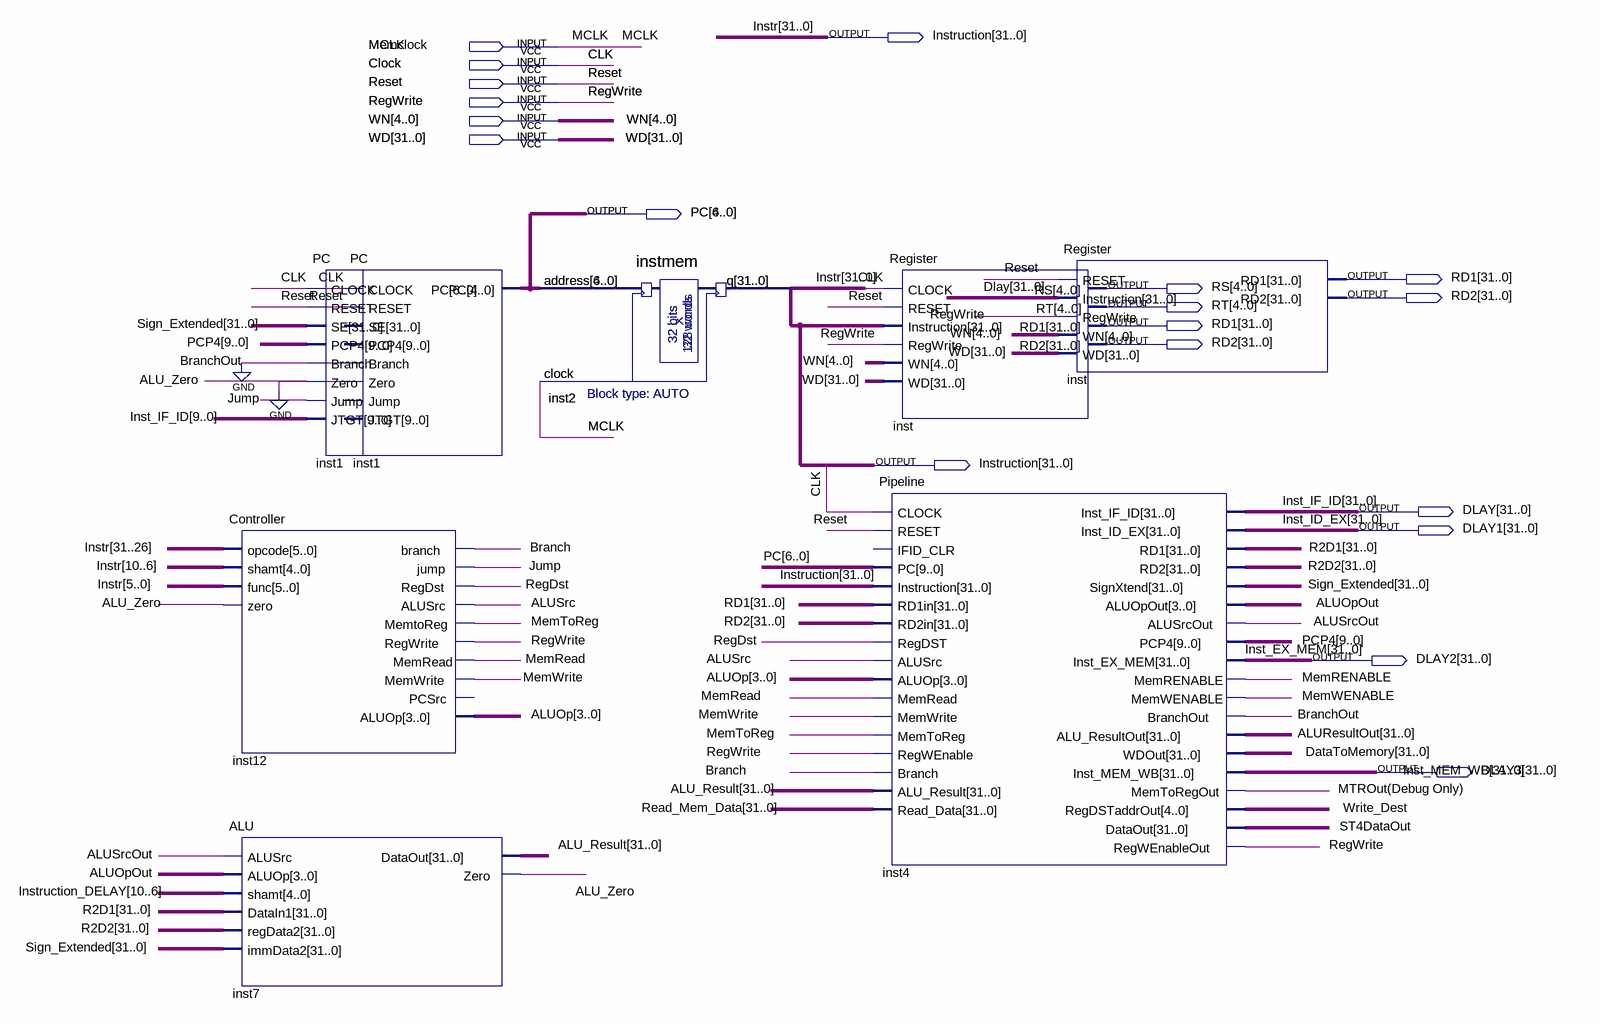
[diagram p0: schematic sheet]
// Quartus schematic TESTER.bdf as structural Verilog: 9 symbols, 26 pins
module TESTER (
  input  Memclock,
  input  MCLK,
  input  Clock,
  input  Reset,
  input  RegWrite,
  input  [4:0] WN,
  input  [31:0] WD,
  output [31:0] Instruction,
  output [6:0] PC,
  output [31:0] RD1,
  output [4:0] RS,
  output [31:0] RD2,
  output [4:0] RT,
  output [31:0] DLAY,
  output [31:0] DLAY1,
  output [31:0] DLAY2,
  output [31:0] DLAY3
);

  wire ALU_Zero, ALUOpOut, ALUSrc, ALUSrcOut, Branch, BranchOut, Jump, MemRead, MemRENABLE, MemToReg,
       MemWENABLE, MemWrite, \MTROut(Debug_Only) , RegDst, ST4DataOut, Write_Dest;
  wire [3:0] ALUOp;
  wire [9:0] PCP4;
  wire [10:6] Instruction_DELAY;
  wire [31:0] ALU_Result, ALUResultOut, DataToMemory, R2D1, R2D2, Read_Mem_Data, Sign_Extended;

  Controller inst12 (
    .opcode(Instruction[31:26]), .shamt(Instruction[10:6]), .func(Instruction[5:0]), .zero(ALU_Zero),
    .branch(Branch), .jump(Jump), .RegDst(RegDst), .ALUSrc(ALUSrc), .MemtoReg(MemToReg), .RegWrite(RegWrite),
    .MemRead(MemRead), .MemWrite(MemWrite), .ALUOp(ALUOp));  // open: PCSrc
  ALU inst7 (
    .ALUSrc(ALUSrcOut), .ALUOp({4{ALUOpOut}}), .shamt(Instruction_DELAY), .DataIn1(R2D1), .regData2(R2D2),
    .immData2(Sign_Extended), .DataOut(ALU_Result), .Zero(ALU_Zero));
  PC inst1 (.CLOCK(Clock), .RESET(Reset), .Branch(BranchOut), .Zero(1'b0), .PC(PC[4:0]));  // open: SE, PCP4, Jump, JTGT
  PC inst1_dup2 (
    .CLOCK(Clock), .RESET(Reset), .SE(Sign_Extended), .PCP4(PCP4), .Branch(BranchOut), .Zero(ALU_Zero),
    .Jump(Jump), .JTGT(DLAY[9:0]), .PC(PC[4:0]));
  instmem inst2 (.address(PC[4:0]), .clock(MCLK), .q(Instruction));
  instmem inst2_dup2 (.address(PC[4:0]), .clock(MCLK), .q(Instruction));
  Pipeline inst4 (
    .CLOCK(Clock), .RESET(Reset), .PC(PC), .Instruction(Instruction), .RD1in(RD1), .RD2in(RD2),
    .RegDST(RegDst), .ALUSrc(ALUSrc), .ALUOp(ALUOp), .MemRead(MemRead), .MemWrite(MemWrite),
    .MemToReg(MemToReg), .RegWEnable(RegWrite), .Branch(Branch), .ALU_Result(ALU_Result),
    .Read_Data(Read_Mem_Data), .Inst_IF_ID(DLAY), .Inst_ID_EX(DLAY1), .RD1(R2D1), .RD2(R2D2),
    .SignXtend(Sign_Extended), .ALUOpOut(ALUOpOut), .ALUSrcOut(ALUSrcOut), .PCP4(PCP4), .Inst_EX_MEM(DLAY2),
    .MemRENABLE(MemRENABLE), .MemWENABLE(MemWENABLE), .BranchOut(BranchOut), .ALU_ResultOut(ALUResultOut),
    .WDOut(DataToMemory), .Inst_MEM_WB(DLAY3), .MemToRegOut(\MTROut(Debug_Only) ),
    .RegDSTaddrOut(Write_Dest), .DataOut(ST4DataOut), .RegWEnableOut(RegWrite));  // open: IFID_CLR
  Register inst (
    .CLOCK(Clock), .RESET(Reset), .Instruction(Instruction), .RegWrite(RegWrite), .WN(WN), .WD(WD), .RS(RS),
    .RT(RT), .RD1(RD1), .RD2(RD2));
  Register inst_dup2 (.RESET(Reset), .Instruction(DLAY), .RegWrite(RegWrite), .WN(WN), .WD(WD), .RD1(RD1), .RD2(RD2));

  assign Memclock = MCLK;
  // also tied to GND on the sheet: BranchOut

  // Other names for the same wires on the sheet: CLK = Clock; Inst_EX_MEM[31:0] = DLAY2; Inst_ID_EX[31:0] = DLAY1;
  //   Inst_IF_ID[31:0] = DLAY; Inst_MEM_WB[31:0] = DLAY3; Instr[31:0] = Instruction
endmodule
